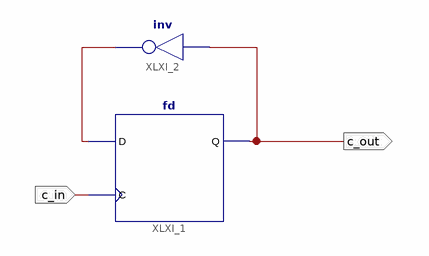
[diagram p0: schematic sheet 1]
// Xilinx ISE schematic DIV_2.sch (spartan6) as structural Verilog: 2 symbols, 2 ports
module DIV_2 (
  input  c_in,
  output c_out
);

  wire XLXN_1;

  fd XLXI_1 (.C(c_in), .D(XLXN_1), .Q(c_out));
  not XLXI_2 (XLXN_1, c_out);
endmodule
